# Altium schematic sheet Zynq Processing System (PS).SchDoc: Zynq Procsessing System
size A3; DocumentNumber: 4; Revision: A; SheetNumber: 4; SheetTotal: 10
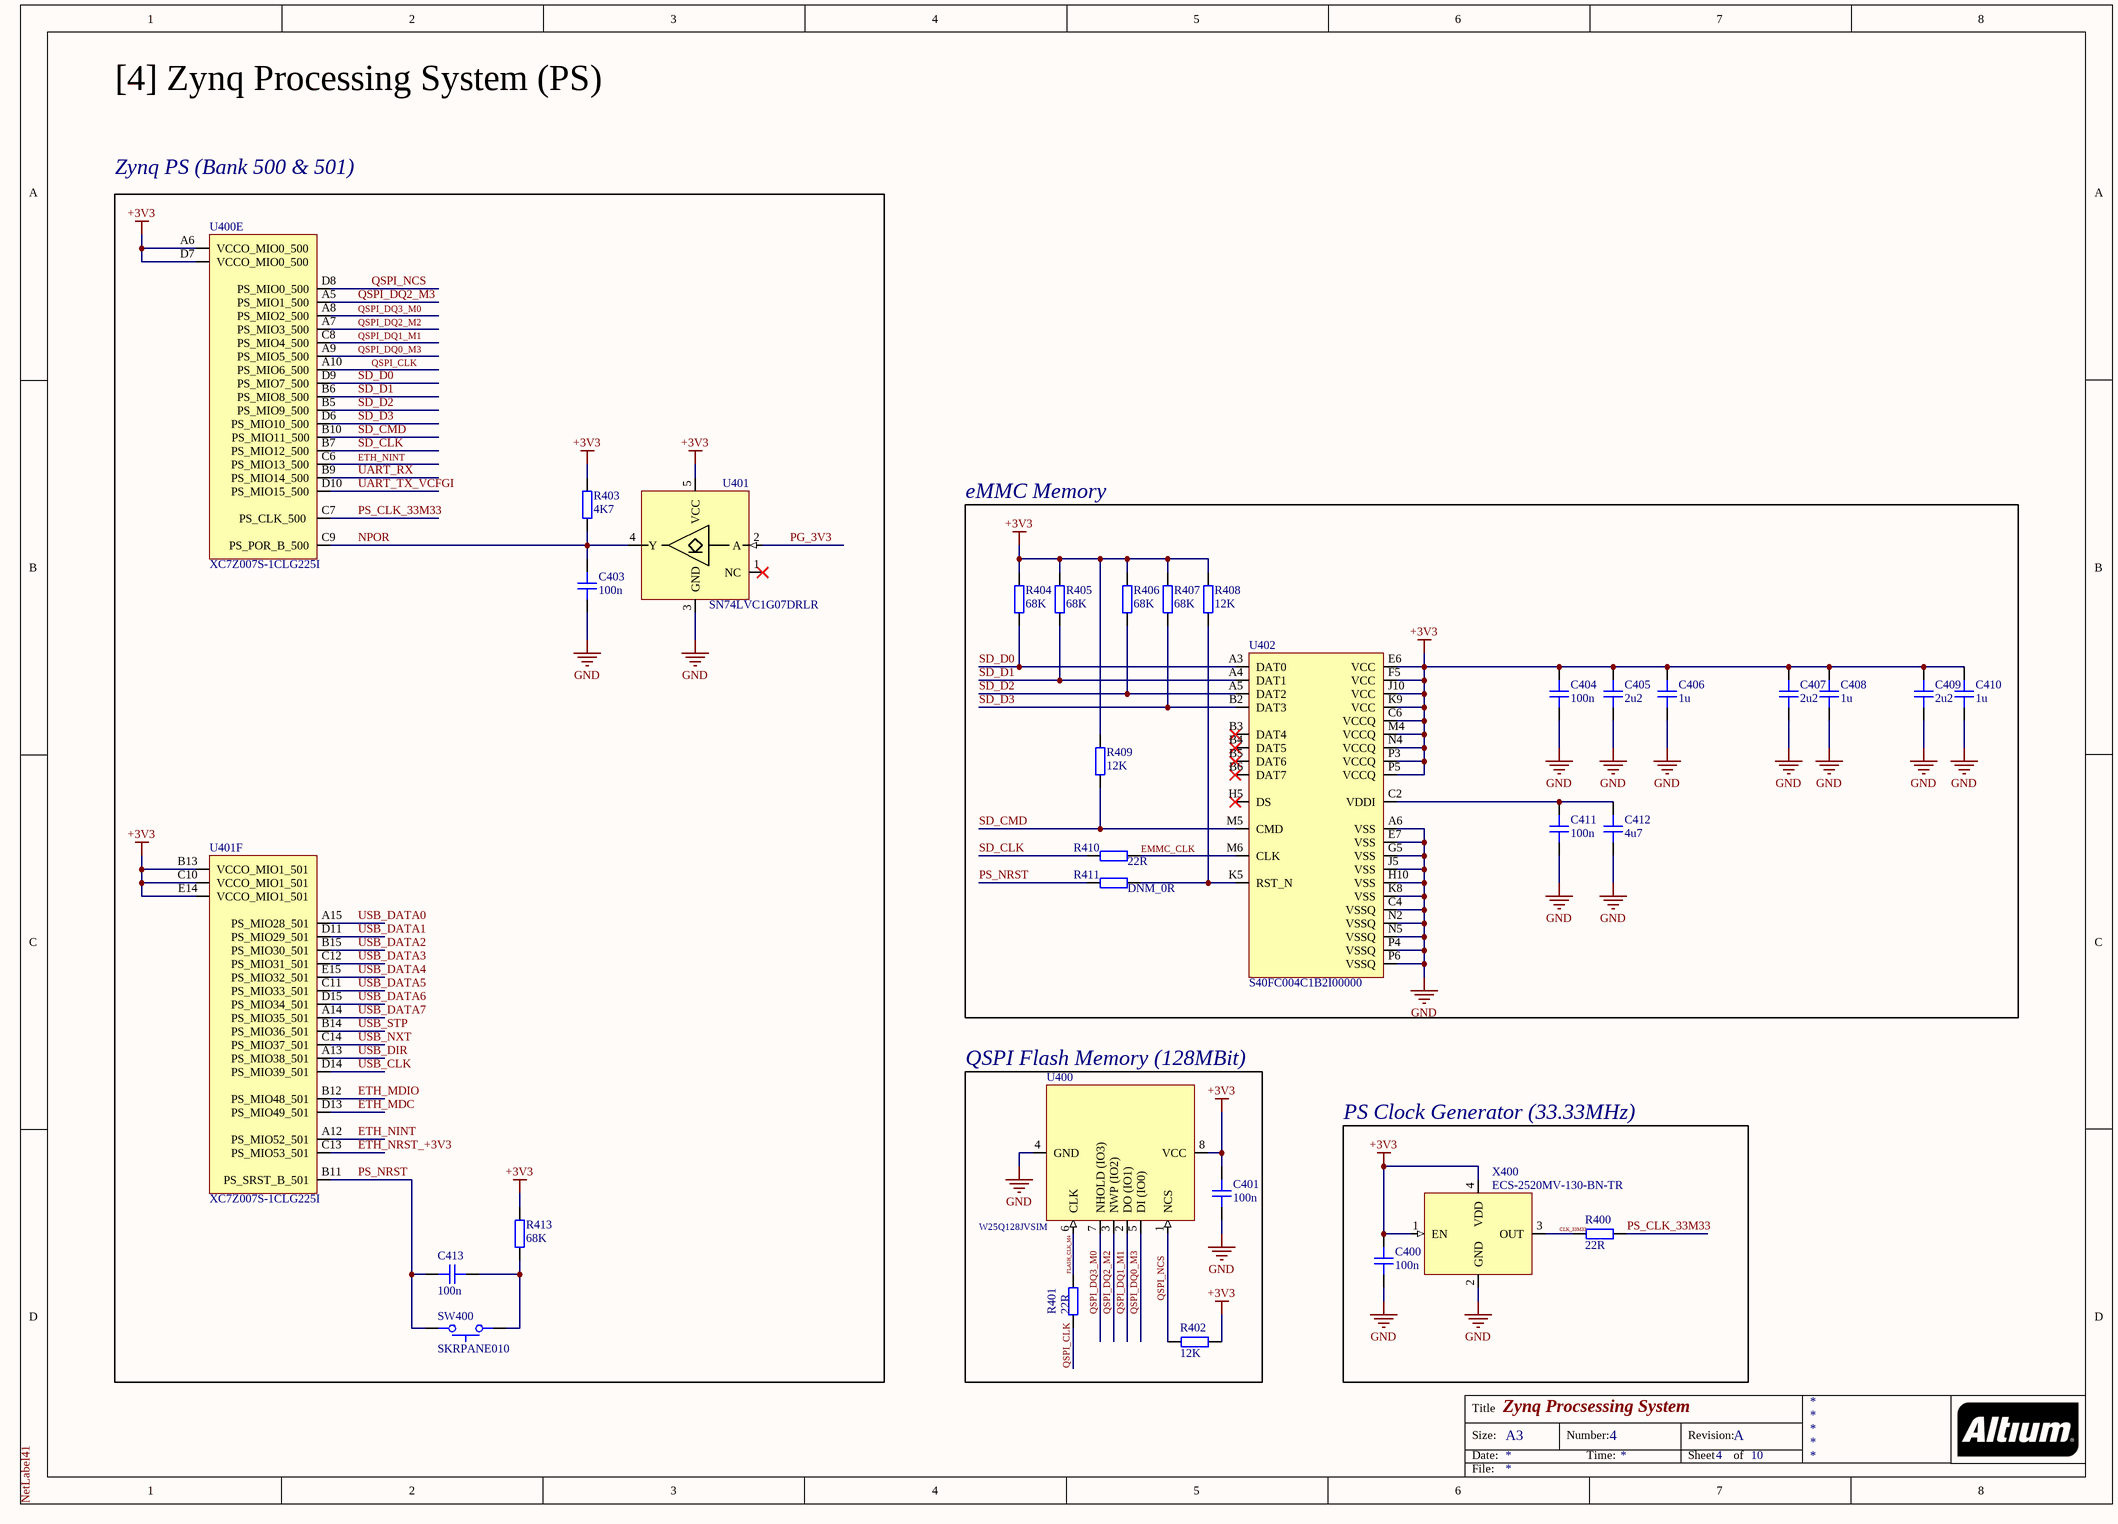
[diagram p0: Zynq Processing System (PS).SchDoc]

## Parts
(Parts that share a designator on the sheet are numbered #1, #2 ... from top to bottom, then left to right.)
C400  100n  [CAP_1210]
C401  100n  [CAP_1210]
C403  100n  [CAP_1210]
C404  100n  [CAP_1210]
C405  2u2  [CAP_1210]
C406  1u  [CAP_1210]
C407  2u2  [CAP_1210]
C408  1u  [CAP_1210]
C409  2u2  [CAP_1210]
C410  1u  [CAP_1210]
C411  100n  [CAP_1210]
C412  4u7  [CAP_1210]
C413  100n  [CAP_1210]
R400  22R  [RES_0402]
R401  22R  [RES_0402]
R402  12K  [RES_0402]
R403  4K7  [RES_0402]
R404  68K  [RES_0402]
R405  68K  [RES_0402]
R406  68K  [RES_0402]
R407  68K  [RES_0402]
R408  12K  [RES_0402]
R409  12K  [RES_0402]
R410  22R  [RES_0402]
R411  DNM_0R  [RES_0402]
R413  68K  [RES_0402]
SW400  SKRPANE010  [SKRPANE010]
U400#1  XC7Z007S-1CLG225I  [CLG225]  (part E of 7)
U400#2  W25Q128JVSIM  [SOIC-8]
U401#1  SN74LVC1G07DRLR  [SOT-5]
U401#2  XC7Z007S-1CLG225I  [CLG225]  (part F of 7)
U402  S40FC004C1B2I00000  [VFBGA153-9.0x7.5x0.8]
X400  ECS-2520MV-130-BN-TR  [XTAL_2520]

## Blocks framed on the sheet
Zynq PS (Bank 500 & 501): C403 C413 R403 R413 SW400 U400#1 U401#1 U401#2
eMMC Memory: C404-C412 R404-R411 U402
QSPI Flash Memory (128MBit): C401 R401 R402 U400#2
PS Clock Generator (33.33MHz): C400 R400 X400

## Nets
+3V3: C400.2 C401.2 C404.2 C405.2 C406.2 C407.2 C408.2 C409.2 C410.2 R402.1 R403.1 R404.1 R405.1 R406.1 R407.1 R408.1 R409.1 R413.2 U400#1.A6(VCCO_MIO0_500) U400#1.D7(VCCO_MIO0_500) U400#2.8(VCC) U401#1.5(VCC) U401#2.B13(VCCO_MIO1_501) U401#2.C10(VCCO_MIO1_501) U401#2.E14(VCCO_MIO1_501) U402.C6(VCCQ) U402.E6(VCC) U402.F5(VCC) U402.J10(VCC) U402.K9(VCC) U402.M4(VCCQ) U402.N4(VCCQ) U402.P3(VCCQ) U402.P5(VCCQ) X400.1(EN) X400.4(VDD)
GND: C400.1 C401.1 C403.1 C404.1 C405.1 C406.1 C407.1 C408.1 C409.1 C410.1 C411.1 C412.1 U400#2.4(GND) U401#1.3(GND) U402.A6(VSS) U402.C4(VSSQ) U402.E7(VSS) U402.G5(VSS) U402.H10(VSS) U402.J5(VSS) U402.K8(VSS) U402.N2(VSSQ) U402.N5(VSSQ) U402.P4(VSSQ) U402.P6(VSSQ) X400.2(GND)
CLK_33M33: R400.1 X400.3(OUT)
EMMC_CLK: R410.2 U402.M6(CLK)
ETH_MDC: U401#2.D13(PS_MIO49_501)
ETH_MDIO: U401#2.B12(PS_MIO48_501)
ETH_NINT: U400#1.C6(PS_MIO13_500) U401#2.A12(PS_MIO52_501)
ETH_NRST_+3V3: U401#2.C13(PS_MIO53_501)
FLASH_CLK_M4: R401.2 U400#2.6(CLK)
NPOR: C403.2 R403.2 U400#1.C9(PS_POR_B_500) U401#1.4(Y)
PG_3V3: U401#1.2(A)
PS_CLK_33M33: R400.2 U400#1.C7(PS_CLK_500)
PS_NRST: C413.2 R411.1 SW400.34 U401#2.B11(PS_SRST_B_501)
QSPI_CLK: R401.1 U400#1.A10(PS_MIO6_500)
QSPI_DQ0_M3: U400#1.A9(PS_MIO5_500) U400#2.5(DI_(IO0))
QSPI_DQ1_M1: U400#1.C8(PS_MIO4_500) U400#2.2(DO_(IO1))
QSPI_DQ2_M2: U400#1.A7(PS_MIO3_500) U400#2.3(NWP_(IO2))
QSPI_DQ2_M3: U400#1.A5(PS_MIO1_500)
QSPI_DQ3_M0: U400#1.A8(PS_MIO2_500) U400#2.7(NHOLD_(IO3))
QSPI_NCS: R402.2 U400#1.D8(PS_MIO0_500) U400#2.1(NCS)
SD_CLK: R410.1 U400#1.B7(PS_MIO12_500)
SD_CMD: R409.2 U400#1.B10(PS_MIO11_500) U402.M5(CMD)
SD_D0: R404.2 U400#1.D9(PS_MIO7_500) U402.A3(DAT0)
SD_D1: R405.2 U400#1.B6(PS_MIO8_500) U402.A4(DAT1)
SD_D2: R406.2 U400#1.B5(PS_MIO9_500) U402.A5(DAT2)
SD_D3: R407.2 U400#1.D6(PS_MIO10_500) U402.B2(DAT3)
UART_RX: U400#1.B9(PS_MIO14_500)
UART_TX_VCFGI: U400#1.D10(PS_MIO15_500)
USB_CLK: U401#2.D14(PS_MIO39_501)
USB_DATA0: U401#2.A15(PS_MIO28_501)
USB_DATA1: U401#2.D11(PS_MIO29_501)
USB_DATA2: U401#2.B15(PS_MIO30_501)
USB_DATA3: U401#2.C12(PS_MIO31_501)
USB_DATA4: U401#2.E15(PS_MIO32_501)
USB_DATA5: U401#2.C11(PS_MIO33_501)
USB_DATA6: U401#2.D15(PS_MIO34_501)
USB_DATA7: U401#2.A14(PS_MIO35_501)
USB_DIR: U401#2.A13(PS_MIO38_501)
USB_NXT: U401#2.C14(PS_MIO37_501)
USB_STP: U401#2.B14(PS_MIO36_501)
NetC411_2: C411.2 C412.2 U402.C2(VDDI)
NetC413_1: C413.1 R413.1 SW400.12
NetR408_2: R408.2 R411.2 U402.K5(RST_N)

Not connected (* = marked no-connect by the designer): U401#1 1(NC)*; U402 B3(DAT4)* B4(DAT5)* B5(DAT6)* B6(DAT7)* H5(DS)*

## Notes on the sheet
- [4] Zynq Processing System (PS)
- Labels drawn without touching a wire or pin: NetLabel41
- Title
- Size:
- Date:
- A3
- Number:
- Time:
- Revision:
- Sheet
- of
- File:

## Library data of the parts
C400 C401 C403-C413 = CAP_1210: Capacitor SMD 1210; Manufacturer: *; Manufacturer Part Number: *; Distributor Link: *; LCSC: *; Rating: *; Dielectric: *
R400-R411 R413 = RES_0402: Resistor SMD 0402; Manufacturer: *; Manufacturer Part Number: *; Distributor Link: *; LCSC: *
SW400 = SKRPANE010: Tactile Switch SMD SPST; Manufacturer: Alps Alpine; Manufacturer Part Number: SKRPANE010
U400#1 U401#2 = XC7Z007S-1CLG225I: Xilinx FPGA SoC Zynq 7-Series XC7Z007S CLG255 Package Industrial Temperature Grade; Manufacturer: Xilinx; Manufacturer Part Number: XC7Z007S-1CLG225I
U400#2 = W25Q128JVSIM: 128M-BIT / SERIAL FLASH MEMORY WITH / DUAL/QUAD SPI & QPI & DTR SOIC-8; Manufacturer: Winbond; Manufacturer Part Number: W25Q128JVSIM
U401#1 = SN74LVC1G07DRLR: Single Buffer/Driver With Open-Drain Output; Manufacturer: Texas Instruments; Manufacturer Part Number: SN74LVC1G07DRLR; Distributor Link: https://www.mouser.de/ProductDetail/Texas-Instruments/SN74LVC1G07DRLR?qs=pajgIaoyDUjwau6f5T7MtQ%3D%3D; LCSC: C183013
U402 = S40FC004C1B2I00000: eMMC MLC Memory 4GB 3V3; Manufacturer: SkyHigh Memory; Manufacturer Part Number: S40FC004C1B2I00000
X400 = ECS-2520MV-130-BN-TR: Standard Clock Oscillators XO (Standard),13MHz,Standby (Power Down),CMOS, Multi-Volt,1.6 V 3.6 V,+/-50ppm,-40 C 85 C,6mA,Surface Mount,4-SMD, No Lead,(2.50mm x 2.00mm),(0.80mm); Manufacturer: ECS; Manufacturer Part Number: ECS-2520MV-130-BN-TR